# EAGLE schematic sensor_28mm_circle (EAGLE 9.1.1)
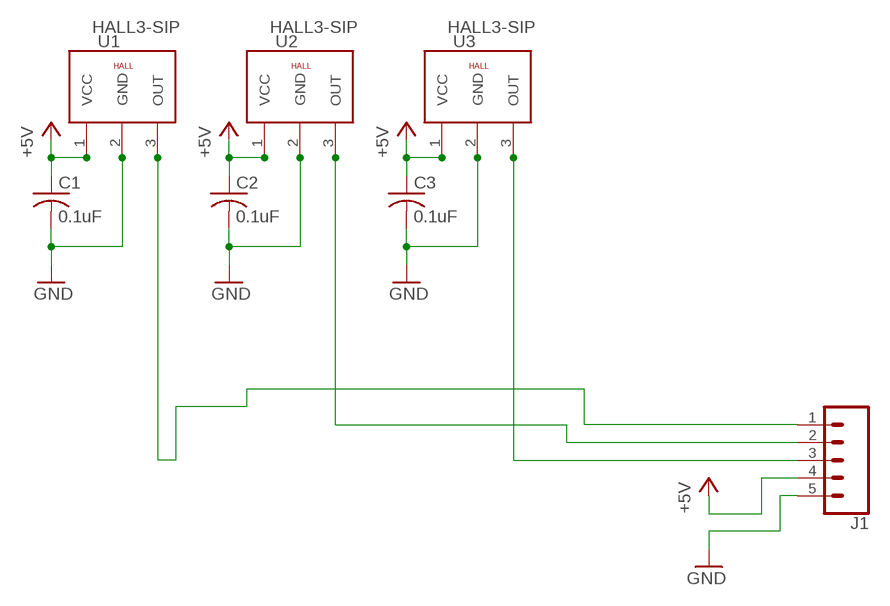
[diagram p0: schematic, sheet 1]

## Parts
C1  0.1uF  C-USC0603  [C0603]
C2  0.1uF  C-USC0603  [C0603]
C3  0.1uF  C-USC0603  [C0603]
J1  CONN_05PTH_LONGPADS  [1X05_LONGPADS]
U1  HALL3-SIP  [3PINS1,27]
U2  HALL3-SIP  [3PINS1,27]
U3  HALL3-SIP  [3PINS1,27]

## Nets
+5V: C1.1 C2.1 C3.1 J1.4 U1.1(VCC) U2.1(VCC) U3.1(VCC)
GND: C1.2 C2.2 C3.2 J1.5 U1.2(GND) U2.2(GND) U3.2(GND)
N$2: J1.1 U1.3(OUT)
N$4: J1.3 U3.3(OUT)
N$7: J1.2 U2.3(OUT)

## Library data of the parts
C1-C3 = rcl:C-US: CAPACITOR, American symbol
J1 = SparkFun-Connectors:CONN_05: Multi connection point. Often used as Generic Header-pin footprint for 0.1 inch spaced/style header connections On any of the 0.1 inch spaced packages, you can populate with these: Break Away Headers - Straight <https://www.sparkfun.com/products/116> (PRT-00116) Break Away Male Headers - Right Angle <https://www.sparkfun.com/products/553> (PRT-00553) Female Headers <https://www.sparkfun.com/products/115> (PRT-00115) Break Away Headers - Machine Pin <https://www.sparkfun.com/products/117> (PRT-00117) Break Away Female Headers - Swiss Machine Pin <https://www.sparkfun.com/products/743> (PRT-00743) For SCREWTERMINALS and SPRING TERMINALS visit here: Screw Terimnals on SparkFun.com <https://www.sparkfun.com/search/results?term=Screw+Terminals> (5mm/3.5mm/2.54mm spacing) This device is also useful as a general connection point to wire up your design to another part of your project. Our various solder wires solder well into these plated through hole pads. Hook-Up Wire - Assortment (Stranded, 22 AWG) <https://www.sparkfun.com/products/11375> (PRT-11375) Hook-Up Wire - Assortment (Solid Core, 22 AWG) <https://www.sparkfun.com/products/11367> (PRT-11367) View the entire wire category on our website here <https://www.sparkfun.com/categories/141> Special notes: Molex polarized connector foot print use with SKU : PRT-08231 with associated crimp pins and housings. 1MM SMD Version SKU: PRT-10208
U1-U3 = charleses_parts_bin:HALL